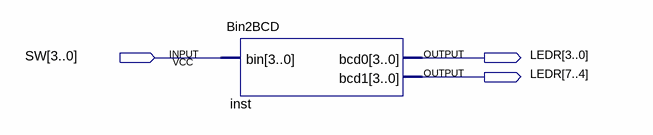
[diagram p0: schematic sheet]
// Quartus schematic bintest.bdf as structural Verilog: 1 symbols, 3 pins
module bintest (
  input  [3:0] SW,
  output [7:0] LEDR
);

  Bin2BCD inst (.bin(SW), .bcd0(LEDR[3:0]), .bcd1(LEDR[7:4]));
endmodule
